# Altium schematic sheet NTC.SchDoc
size A4; SheetNumber: 3; SheetTotal: 4
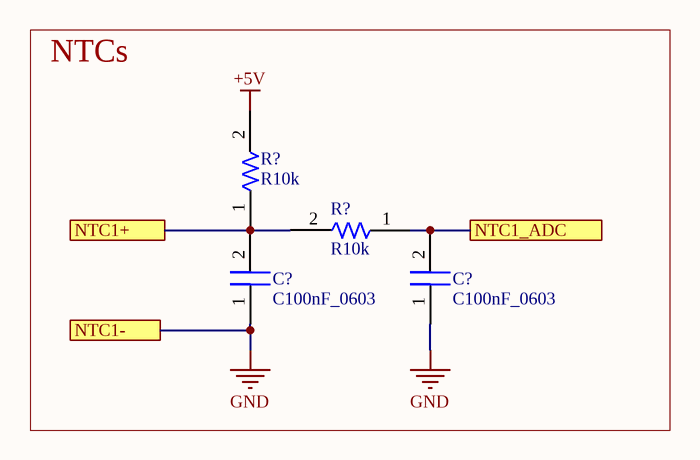
[diagram p0: NTC.SchDoc]

## Parts
(Parts that share a designator on the sheet are numbered #1, #2 ... from top to bottom, then left to right.)
C?#1  C100nF_0603  [Chip2PinSM127P600-8N]
C?#2  C100nF_0603  [Chip2PinSM127P600-8N]
R?#1  R10k  [R0603]
R?#2  R10k  [R0603]

## Blocks framed on the sheet
NTCs: C?#1 C?#2 R?#1 R?#2

## Ports
NTC1+, NTC1-, NTC1_ADC

## Nets
+5V: R?#1.2
GND: C?#1.1 C?#2.1 ; port NTC1-
NTC1+: C?#1.2 R?#1.1 R?#2.2 ; port NTC1+
NTC1_ADC: C?#2.2 R?#2.1 ; port NTC1_ADC

## Library data of the parts
R?#1 R?#2 = R10k_0603